# Altium schematic sheet TorpedoSOM_ReceptorS.SchDoc
size A3; DocumentNumber: 3; SheetNumber: 3; SheetTotal: 9
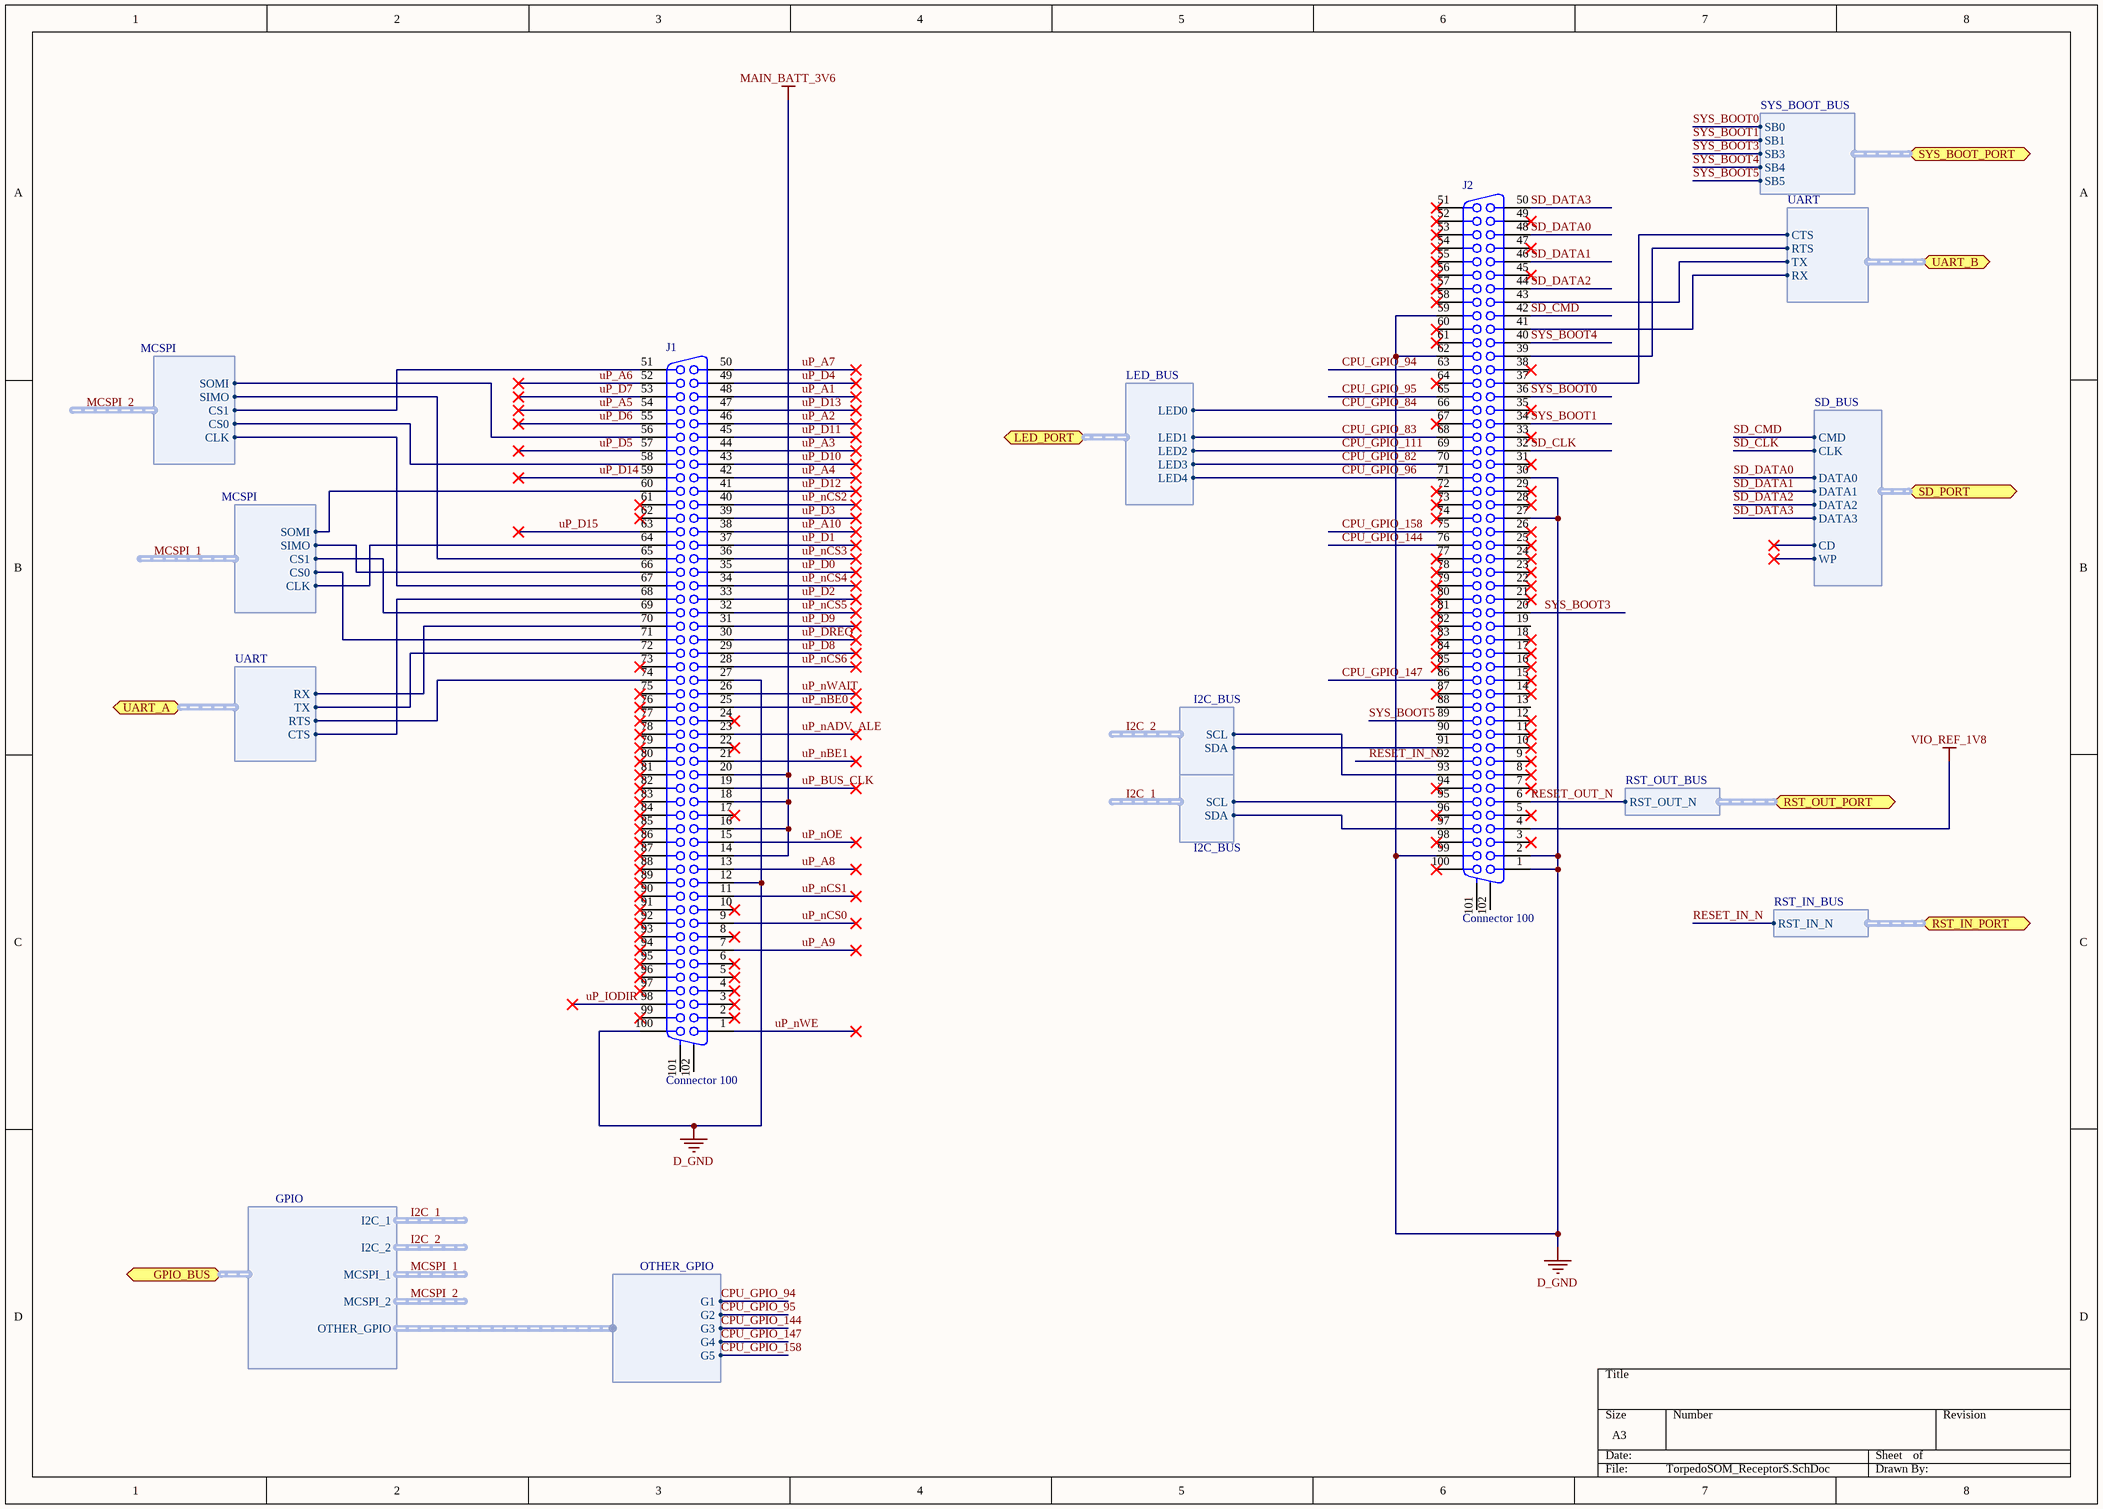
[diagram p0: TorpedoSOM_ReceptorS.SchDoc]

## Parts
J1  Connector 100  [SOP127P600-8N_100PinConnRecptr_Hirose]
J2  Connector 100  [SOP127P600-8N_100PinConnRecptr_Hirose]

## Ports
GPIO_BUS (harness GPIO), LED_PORT (harness LED_BUS), RST_IN_PORT (harness RST_IN_BUS), RST_OUT_PORT (harness RST_OUT_BUS), SD_PORT (harness SD_BUS), SYS_BOOT_PORT (harness SYS_BOOT_BUS), UART_A (harness UART), UART_B (harness UART)

## Harnesses
MCSPI: CLK, CS0, CS1, SIMO, SOMI
UART: CTS, RTS, TX, RX
GPIO: I2C_1, I2C_2, MCSPI_1, MCSPI_2, OTHER_GPIO
OTHER_GPIO: G1, G2, G3, G4, G5
SD_BUS: CMD, CLK, DATA0, DATA1, DATA2, DATA3, CD, WP
I2C_BUS: SDA, SCL
SYS_BOOT_BUS: SB0, SB1, SB3, SB4, SB5
RST_IN_BUS: RST_IN_N
LED_BUS: LED0, LED1, LED2, LED3, LED4
RST_OUT_BUS: RST_OUT_N

## Nets
D_GND: J1.12 J1.27 J1.100 J2.1 J2.2 J2.27 J2.30 J2.59 J2.62 J2.99
MAIN_BATT_3V6: J1.14 J1.16 J1.18 J1.20
VIO_REF_1V8: J2.4
CPU_GPIO_82: J2.70 ; port LED_PORT.LED3
CPU_GPIO_83: J2.68 ; port LED_PORT.LED1
CPU_GPIO_84: J2.66 ; port LED_PORT.LED0
CPU_GPIO_94: J2.63 ; harness OTHER_GPIO.G1
CPU_GPIO_95: J2.65 ; harness OTHER_GPIO.G2
CPU_GPIO_96: J2.71 ; port LED_PORT.LED4
CPU_GPIO_111: J2.69 ; port LED_PORT.LED2
CPU_GPIO_144: J2.76 ; harness OTHER_GPIO.G3
CPU_GPIO_147: J2.86 ; harness OTHER_GPIO.G4
CPU_GPIO_158: J2.75 ; harness OTHER_GPIO.G5
I2C_1.SCL: J2.95 ; harness I2C_BUS.SCL
I2C_1.SDA: J2.97 ; harness I2C_BUS.SDA
I2C_2.SCL: J2.93 ; harness I2C_BUS.SCL
I2C_2.SDA: J2.91 ; harness I2C_BUS.SDA
MCSPI_1.CLK: J1.64 ; harness MCSPI.CLK
MCSPI_1.CS0: J1.71 ; harness MCSPI.CS0
MCSPI_1.CS1: J1.69 ; harness MCSPI.CS1
MCSPI_1.SIMO: J1.66 ; harness MCSPI.SIMO
MCSPI_1.SOMI: J1.60 ; harness MCSPI.SOMI
MCSPI_2.CLK: J1.67 ; harness MCSPI.CLK
MCSPI_2.CS0: J1.58 ; harness MCSPI.CS0
MCSPI_2.CS1: J1.51 ; harness MCSPI.CS1
MCSPI_2.SIMO: J1.65 ; harness MCSPI.SIMO
MCSPI_2.SOMI: J1.56 ; harness MCSPI.SOMI
RESET_IN_N: J2.92 ; port RST_IN_PORT.RST_IN_N
RESET_OUT_N: J2.6 ; port RST_OUT_PORT.RST_OUT_N
SD_CLK: J2.32 ; port SD_PORT.CLK
SD_CMD: J2.42 ; port SD_PORT.CMD
SD_DATA0: J2.48 ; port SD_PORT.DATA0
SD_DATA1: J2.46 ; port SD_PORT.DATA1
SD_DATA2: J2.44 ; port SD_PORT.DATA2
SD_DATA3: J2.50 ; port SD_PORT.DATA3
SYS_BOOT0: J2.36 ; port SYS_BOOT_PORT.SB0
SYS_BOOT1: J2.34 ; port SYS_BOOT_PORT.SB1
SYS_BOOT3: J2.20 ; port SYS_BOOT_PORT.SB3
SYS_BOOT4: J2.40 ; port SYS_BOOT_PORT.SB4
SYS_BOOT5: J2.89 ; port SYS_BOOT_PORT.SB5
uP_A1: J1.48
uP_A2: J1.46
uP_A3: J1.44
uP_A4: J1.42
uP_A5: J1.54
uP_A6: J1.52
uP_A7: J1.50
uP_A8: J1.13
uP_A9: J1.7
uP_A10: J1.38
uP_BUS_CLK: J1.19
uP_D0: J1.35
uP_D1: J1.37
uP_D2: J1.33
uP_D3: J1.39
uP_D4: J1.49
uP_D5: J1.57
uP_D6: J1.55
uP_D7: J1.53
uP_D8: J1.29
uP_D9: J1.31
uP_D10: J1.43
uP_D11: J1.45
uP_D12: J1.41
uP_D13: J1.47
uP_D14: J1.59
uP_D15: J1.63
uP_DREQ: J1.30
uP_IODIR: J1.98
uP_nADV_ALE: J1.23
uP_nBE0: J1.25
uP_nBE1: J1.21
uP_nCS0: J1.9
uP_nCS1: J1.11
uP_nCS2: J1.40
uP_nCS3: J1.36
uP_nCS4: J1.34
uP_nCS5: J1.32
uP_nCS6: J1.28
uP_nOE: J1.15
uP_nWAIT: J1.26
uP_nWE: J1.1
NetJ1_68: J1.68 ; port UART_A.CTS
NetJ1_70: J1.70 ; port UART_A.RX
NetJ1_72: J1.72 ; port UART_A.TX
NetJ1_74: J1.74 ; port UART_A.RTS
NetJ2_37: J2.37 ; port UART_B.CTS
NetJ2_39: J2.39 ; port UART_B.RTS
NetJ2_41: J2.41 ; port UART_B.RX
NetJ2_43: J2.43 ; port UART_B.TX

Not connected (* = marked no-connect by the designer): J1 2* 3* 4* 5* 6* 8* 10* 17* 22* 24* 61* 62* 73* 75* 76* 77* 78* 79* 80* 81* 82* 83* 84* 85* 86* 87* 88* 89* 90* 91* 92* 93* 94* 95* 96* 97* 99* 101(MH1) 102(MH2); J2 3* 5* 7* 8* 9* 10* 11* 12* 13 14* 15* 16* 17* 18* 19 21* 22* 23* 24* 25* 26* 28* 29* 31* 33* 35* 38* 45* 47* 49* 51* 52* 53* 54* 55* 56* 57* 58* 60* 61* 64* 67* 72* 73* 74* 77* 78* 79* 80* 81* 82* 83* 84* 85* 87* 88 90 94* 96* 98* 100* 101(MH1) 102(MH2)

## Library data of the parts
J1 J2 = Connector 100: Receptacle Header Assemby; PackageDocument: B; Positions: 100; Published: 15-Jun-2001; LatestRevisionDate: 17-Jul-2002; LatestRevisionNote: Re-released for DXP Platform.; DatasheetDocument: 1-Oct-1983; PackageReference: 178240-9; Publisher: Altium Limited; Orientation: Right Angle